# Altium schematic sheet SENSOR.SchDoc: Sensor
size A4; Author: eldar6776@hotmail.com; DrawnBy: Eldar Dedić; Organization: PROVEN d.o.o.; Address1: Adema Buće 102; Address2: 71000 Sarajevo; Address3: Federacija BiH; Address4: Bosna i Hercegovina; DocumentNumber: DE091114; Revision: 001; SheetNumber: 1; SheetTotal: 2; ProjectName: ABSOLUT_ENCODER
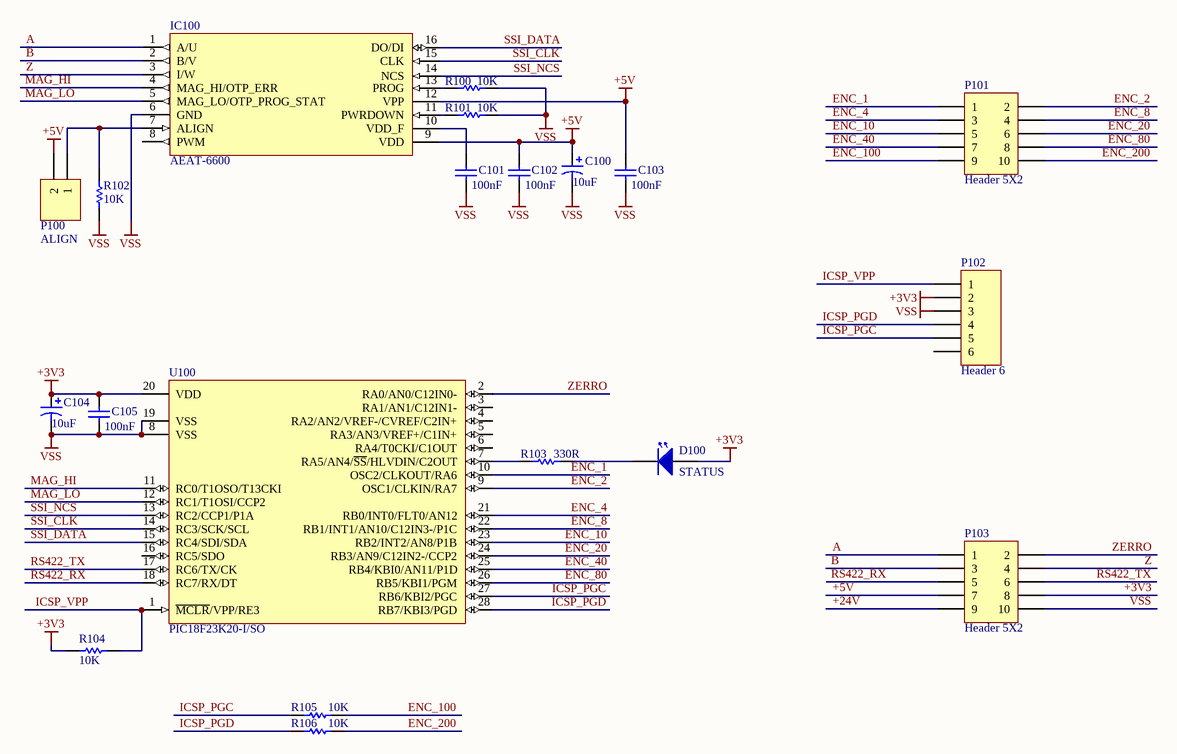
[diagram p0: SENSOR.SchDoc]

## Parts
C100  10uF  [C]
C101  value 100nF  [0805]
C102  value 100nF  [0805]
C103  value 100nF  [0805]
C104  10uF  [C]
C105  value 100nF  [0805]
D100  STATUS  [LED 3mm]
IC100  AEAT-6600  [TSSOP16]
P100  ALIGN  [HDR1X2]
P101  Header 5X2  [HDR2X5]
P102  Header 6  [HDR1X6]
P103  Header 5X2  [HDR2X5]
R100  10K  [ERA-0603]
R101  10K  [ERA-0603]
R102  10K  [ERA-0603]
R103  330R  [ERA-0603]
R104  10K  [ERA-0603]
R105  10K  [ERA-0603]
R106  10K  [ERA-0603]
U100  PIC18F23K20-I/SO  [SOIC-SO28_N]

## Nets
+3V3: C104.1 C105.2 D100.2 P102.2 P103.8 R104.2 U100.20(VDD)
+5V: C100.1 C102.2 C103.2 IC100.9(VDD) IC100.12(VPP) P100.2 P103.7
VSS: C100.2 C101.1 C102.1 C103.1 C104.2 C105.1 IC100.6(GND) P102.3 P103.10 R100.1 R101.1 R102.1 U100.8(VSS) U100.19(VSS)
+24V: P103.9
A: IC100.1(A/U) P103.1
B: IC100.2(B/V) P103.3
ENC_1: P101.1 U100.10(OSC2/CLKOUT/RA6)
ENC_2: P101.2 U100.9(OSC1/CLKIN/RA7)
ENC_4: P101.3 U100.21(RB0/INT0/FLT0/AN12)
ENC_8: P101.4 U100.22(RB1/INT1/AN10/C12IN3-/P1C)
ENC_10: P101.5 U100.23(RB2/INT2/AN8/P1B)
ENC_20: P101.6 U100.24(RB3/AN9/C12IN2-/CCP2)
ENC_40: P101.7 U100.25(RB4/KBI0/AN11/P1D)
ENC_80: P101.8 U100.26(RB5/KBI1/PGM)
ENC_100: P101.9 R105.1
ENC_200: P101.10 R106.1
ICSP_PGC: P102.5 R105.2 U100.27(RB6/KBI2/PGC)
ICSP_PGD: P102.4 R106.2 U100.28(RB7/KBI3/PGD)
ICSP_VPP: P102.1 R104.1 U100.1(~{MCLR}/VPP/RE3)
MAG_HI: IC100.4(MAG_HI/OTP_ERR) U100.11(RC0/T1OSO/T13CKI)
MAG_LO: IC100.5(MAG_LO/OTP_PROG_STAT) U100.12(RC1/T1OSI/CCP2)
RS422_RX: P103.5 U100.18(RC7/RX/DT)
RS422_TX: P103.6 U100.17(RC6/TX/CK)
SSI_CLK: IC100.15(CLK) U100.14(RC3/SCK/SCL)
SSI_DATA: IC100.16(DO/DI) U100.15(RC4/SDI/SDA)
SSI_NCS: IC100.14(NCS) U100.13(RC2/CCP1/P1A)
Z: IC100.3(I/W) P103.4
ZERRO: P103.2 U100.2(RA0/AN0/C12IN0-)
NetC101_2: C101.2 IC100.10(VDD_F)
NetD100_1: D100.1 R103.2
NetIC100_7: IC100.7(ALIGN) P100.1 R102.2
NetIC100_11: IC100.11(PWRDOWN) R101.2
NetIC100_13: IC100.13(PROG) R100.2
NetR103_1: R103.1 U100.7(RA5/AN4/~{SS}/HLVDIN/C2OUT)

Not connected (* = marked no-connect by the designer): IC100 8(PWM); P102 6; U100 3(RA1/AN1/C12IN1-) 4(RA2/AN2/VREF-/CVREF/C2IN+) 5(RA3/AN3/VREF+/C1IN+) 6(RA4/T0CKI/C1OUT) 16(RC5/SDO)

## Notes on the sheet
- Title
- Size:
- Date:
- A4
- Number:
- Time:
- Revision:
- Sheet
- of
- File:

## Library data of the parts
C100 C104 = 94SC106X0016CBP: Solid Aluminum Capacitor with Organic Semiconductor Electrolyte: 10uF, 16V, Bulk Pack; Note: Part Numbers shown are for ± 20% capacitance tolerance (X0).; PCB_Layout: Complies with Manufacturer's Recommendation.; DrillSize: Nominal, Rounded to the nearest 0.1mm; Published: 19-Mar-2004; DatasheetDocument: 23-May-2001; PackageReference: C; Publisher: Altium Limited; ComponentLink1Description: Manufacturer Link; ComponentLink1URL: http://www.vishay.com/; ComponentLink2Description: Datasheet; ComponentLink2URL: http://www.vishay.com/docs/90004/94sc.pdf; Value: 10uF
C101-C103 C105 = C0805: Ceramic Chip Capacitor - Standard; Note: Footprint corresponds to dimensions for bulk cassette packaging. This case size has tightened tolerances.; Published: 17-Jul-2002; LatestRevisionDate: 19-Mar-2004; LatestRevisionNote: Silkscreen size reduced.; DatasheetDocument: Mar-2001; PackageDocument: Mar-2001; PackageReference: 0805; Publisher: Altium Limited; Code_JEITA: 0805; Code_IPC: 2012[0805]; ComponentLink1Description: Manufacturer Link; ComponentLink1URL: http://www.kemet.com/; ComponentLink2Description: Datasheet; ComponentLink2URL: http://www.kemet.com/kemet/web/homepage/kechome.nsf/vapubfilesname/F3102TA.pdf/$file/F3102TA.pdf
D100 = LED 3mm yellow: LED dioda 3 mm
IC100 = AEAT-6600: Absolute encoder IC
P100 = Header 2: Header, 2-Pin; LatestRevisionDate: 17-Jul-2002; LatestRevisionNote: Re-released for DXP Platform.; Publisher: Altium Limited
P101 P103 = Header 5X2: Header, 5-Pin, Dual row; LatestRevisionDate: 17-Jul-2002; LatestRevisionNote: Re-released for DXP Platform.; Publisher: Altium Limited
P102 = Header 6: Header, 6-Pin; LatestRevisionDate: 17-Jul-2002; LatestRevisionNote: Re-released for DXP Platform.; Publisher: Altium Limited
R100-R106 = ERAV: Metal Film Thermosensitive Chip Resistor, 0.56 Ohm to 10k Ohm Range, 5% Tolerance, 0603 Size, 0.063 W; Note: If flow soldering, adjust pad width of PCB Footprint to 0.7 - 0.8 times the width of the resistor.; Published: 17-Dec-2003; LatestRevisionDate: 19-Mar-2004; LatestRevisionNote: Silkscreen size reduced.; PackageDocument: Mar-2003; PackageReference: ERA-0603; Publisher: Altium Limited; Code_IPC: 1608 [0603]; ComponentLink1Description: Manufacturer Link; ComponentLink1URL: http://www.panasonic.com/industrial/components/resistive_products.htm; ComponentLink2Description: Datasheet; ComponentLink2URL: http://www.panasonic.com/industrial/components/pdf/AOF0000CE1.pdf
U100 = PIC18F23K20-I/SO: Flash Microcontroller with nanoWatt XLP Technology, 28-pin SOIC, Industrial Temperature; Published: 2-Dec-2009; DatasheetVersion: revF, Sep-2009; PackageVersion: revBB, Aug-2009; PackageReference: SOIC-SO28; Publisher: Altium Limited; PackageDescription: 28-Lead Plastic Small Outline (SO) - Wide 7.50mm Body [SOIC]; Supplier 1: Digi-Key; Supplier Part Number 1: PIC18F23K20-I/SO-ND; Supplier 2: Farnell; Supplier Part Number 2: 1700989; Code_JEDEC: MS-013; ComponentLink1Description: Datasheet; ComponentLink1URL: http://ww1.microchip.com/downloads/en/DeviceDoc/41303F.pdf; ComponentLink2Description: Packaging Specification; ComponentLink2URL: http://www.microchip.com/stellent/groups/techpub_sg/documents/packagingspec/en012702.pdf; ComponentLink3Description: Microchip.com Home; ComponentLink3URL: http://www.microchip.com/